# EAGLE schematic altera_dev_brd (EAGLE 4.16)
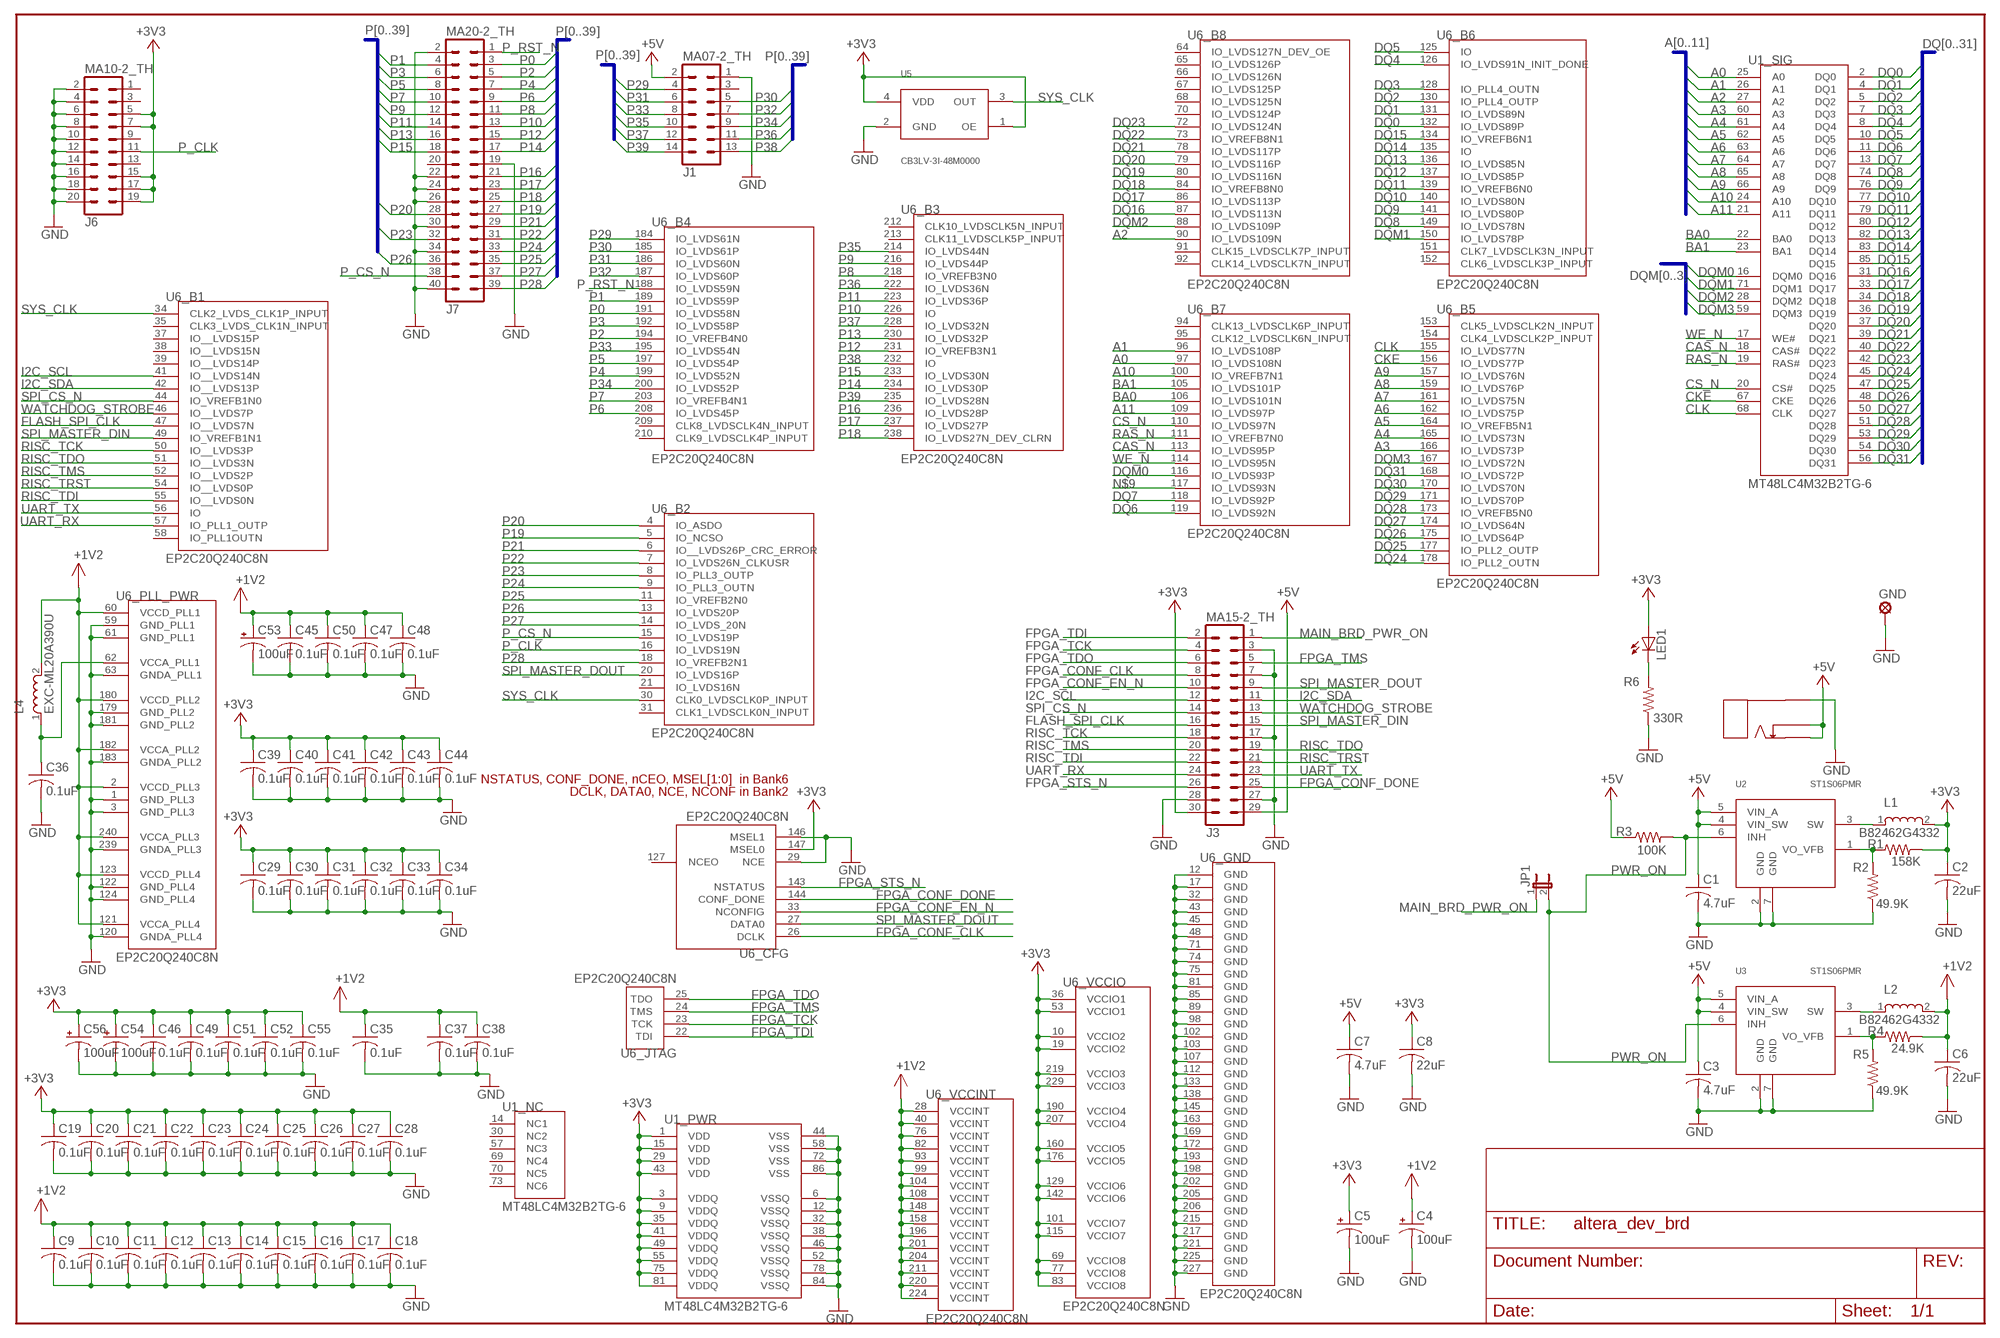
[diagram p0: schematic, sheet 1]

## Parts
C1  4.7uF  C-USC0805  [C0805]
C2  22uF  C-USC0805  [C0805]
C3  4.7uF  C-USC0805  [C0805]
C4  100uF  CPOL-USCT3528  [CT3528]
C5  100uF  CPOL-USCT3528  [CT3528]
C6  22uF  C-USC0805  [C0805]
C7  4.7uF  C-USC0805  [C0805]
C8  22uF  C-USC0805  [C0805]
C9  0.1uF  C-USC0603  [C0603]
C10  0.1uF  C-USC0603  [C0603]
C11  0.1uF  C-USC0603  [C0603]
C12  0.1uF  C-USC0603  [C0603]
C13  0.1uF  C-USC0603  [C0603]
C14  0.1uF  C-USC0603  [C0603]
C15  0.1uF  C-USC0603  [C0603]
C16  0.1uF  C-USC0603  [C0603]
C17  0.1uF  C-USC0603  [C0603]
C18  0.1uF  C-USC0603  [C0603]
C19  0.1uF  C-USC0603  [C0603]
C20  0.1uF  C-USC0603  [C0603]
C21  0.1uF  C-USC0603  [C0603]
C22  0.1uF  C-USC0603  [C0603]
C23  0.1uF  C-USC0603  [C0603]
C24  0.1uF  C-USC0603  [C0603]
C25  0.1uF  C-USC0603  [C0603]
C26  0.1uF  C-USC0603  [C0603]
C27  0.1uF  C-USC0603  [C0603]
C28  0.1uF  C-USC0603  [C0603]
C29  0.1uF  C-USC0603  [C0603]
C30  0.1uF  C-USC0603  [C0603]
C31  0.1uF  C-USC0603  [C0603]
C32  0.1uF  C-USC0603  [C0603]
C33  0.1uF  C-USC0603  [C0603]
C34  0.1uF  C-USC0603  [C0603]
C35  0.1uF  C-USC0603  [C0603]
C36  0.1uF  C-USC0603  [C0603]
C37  0.1uF  C-USC0603  [C0603]
C38  0.1uF  C-USC0603  [C0603]
C39  0.1uF  C-USC0603  [C0603]
C40  0.1uF  C-USC0603  [C0603]
C41  0.1uF  C-USC0603  [C0603]
C42  0.1uF  C-USC0603  [C0603]
C43  0.1uF  C-USC0603  [C0603]
C44  0.1uF  C-USC0603  [C0603]
C45  0.1uF  C-USC0603  [C0603]
C46  0.1uF  C-USC0603  [C0603]
C47  0.1uF  C-USC0603  [C0603]
C48  0.1uF  C-USC0603  [C0603]
C49  0.1uF  C-USC0603  [C0603]
C50  0.1uF  C-USC0603  [C0603]
C51  0.1uF  C-USC0603  [C0603]
C52  0.1uF  C-USC0603  [C0603]
C53  100uF  CPOL-USCT3528  [CT3528]
C54  100uF  CPOL-USCT3528  [CT3528]
C55  0.1uF  C-USC0603  [C0603]
C56  100uF  CPOL-USCT3528  [CT3528]
GND  LSP10  [LSP10]
J1  MA07-2_TH  [MA07-2_TH]
J2  RASH722  [RASH722]
J3  MA15-2_TH  [MA15-2_TH]
J6  MA10-2_TH  [MA10-2_TH]
J7  MA20-2_TH  [MA20-2_TH]
JP1  JP1E  [JP1]
L1  B82462G4332  [B82462G4]
L2  B82462G4332  [B82462G4]
L4  EXC-ML20A390U  [IND_PANASONIC_0603]
LED1  LEDCHIP-LED0603  [CHIP-LED0603]
R1  158K  R-US_R0603  [R0603]
R2  49.9K  R-US_R0603  [R0603]
R3  100K  R-US_R0603  [R0603]
R4  24.9K  R-US_R0603  [R0603]
R5  49.9K  R-US_R0603  [R0603]
R6  330R  R-US_R0603  [R0603]
U1  MT48LC4M32B2TG-6  [TSOP86]
U2  ST1S06PMR  [DFN6]
U3  ST1S06PMR  [DFN6]
U5  CB3LV-3I-48M0000  [OSC_7MM]
U6  EP2C20Q240C8N  [PQFP240]

## Nets
+1V2: C4.+ C6.1 C9.1 C10.1 C11.1 C12.1 C13.1 C14.1 C15.1 C16.1 C17.1 C18.1 C35.1 C37.1 C38.1 C45.1 C47.1 C48.1 C50.1 C53.+ L2.2 L4.2 R4.2 U6.2(_PLL_PWR:VCCD_PLL3) U6.28(_VCCINT:VCCINT) U6.40(_VCCINT:VCCINT) U6.60(_PLL_PWR:VCCD_PLL1) U6.76(_VCCINT:VCCINT) U6.82(_VCCINT:VCCINT) U6.93(_VCCINT:VCCINT) U6.99(_VCCINT:VCCINT) U6.104(_VCCINT:VCCINT) U6.108(_VCCINT:VCCINT) U6.121(_PLL_PWR:VCCA_PLL4) U6.123(_PLL_PWR:VCCD_PLL4) U6.148(_VCCINT:VCCINT) U6.158(_VCCINT:VCCINT) U6.180(_PLL_PWR:VCCD_PLL2) U6.182(_PLL_PWR:VCCA_PLL2) U6.196(_VCCINT:VCCINT) U6.201(_VCCINT:VCCINT) U6.204(_VCCINT:VCCINT) U6.211(_VCCINT:VCCINT) U6.220(_VCCINT:VCCINT) U6.224(_VCCINT:VCCINT) U6.240(_PLL_PWR:VCCA_PLL3)
+3V3: C2.1 C5.+ C8.1 C19.1 C20.1 C21.1 C22.1 C23.1 C24.1 C25.1 C26.1 C27.1 C28.1 C29.1 C30.1 C31.1 C32.1 C33.1 C34.1 C39.1 C40.1 C41.1 C42.1 C43.1 C44.1 C46.1 C49.1 C51.1 C52.1 C54.+ C55.1 C56.+ J3.30 J6.5 J6.7 J6.15 J6.17 J6.19 L1.2 LED1.A R1.2 U1.1(_PWR:VDD) U1.3(_PWR:VDDQ) U1.9(_PWR:VDDQ) U1.15(_PWR:VDD) U1.29(_PWR:VDD) U1.35(_PWR:VDDQ) U1.41(_PWR:VDDQ) U1.43(_PWR:VDD) U1.49(_PWR:VDDQ) U1.55(_PWR:VDDQ) U1.75(_PWR:VDDQ) U1.81(_PWR:VDDQ) U5.1(OE) U5.4(VDD) U6.10(_VCCIO:VCCIO2) U6.19(_VCCIO:VCCIO2) U6.36(_VCCIO:VCCIO1) U6.53(_VCCIO:VCCIO1) U6.69(_VCCIO:VCCIO8) U6.77(_VCCIO:VCCIO8) U6.83(_VCCIO:VCCIO8) U6.101(_VCCIO:VCCIO7) U6.115(_VCCIO:VCCIO7) U6.129(_VCCIO:VCCIO6) U6.142(_VCCIO:VCCIO6) U6.147(_CFG:MSEL0) U6.160(_VCCIO:VCCIO5) U6.176(_VCCIO:VCCIO5) U6.190(_VCCIO:VCCIO4) U6.207(_VCCIO:VCCIO4) U6.219(_VCCIO:VCCIO3) U6.229(_VCCIO:VCCIO3)
+5V: C1.1 C3.1 C7.1 J1.2 J2.2(SHNT) J2.3(CNTR) J3.29 R3.1 U2.4(VIN_SW) U2.5(VIN_A) U3.4(VIN_SW) U3.5(VIN_A)
A0: U1.25(_SIG:A0) U6.97(_B7:IO_LVDS108N)
A1: U1.26(_SIG:A1) U6.96(_B7:IO_LVDS108P)
A2: U1.27(_SIG:A2) U6.90(_B8:IO_LVDS109N)
A3: U1.60(_SIG:A3) U6.166(_B5:IO_LVDS73P)
A4: U1.61(_SIG:A4) U6.165(_B5:IO_LVDS73N)
A5: U1.62(_SIG:A5) U6.164(_B5:IO_VREFB5N1)
A6: U1.63(_SIG:A6) U6.162(_B5:IO_LVDS75P)
A7: U1.64(_SIG:A7) U6.161(_B5:IO_LVDS75N)
A8: U1.65(_SIG:A8) U6.159(_B5:IO_LVDS76P)
A9: U1.66(_SIG:A9) U6.157(_B5:IO_LVDS76N)
A10: U1.24(_SIG:A10) U6.100(_B7:IO_VREFB7N1)
A11: U1.21(_SIG:A11) U6.109(_B7:IO_LVDS97P)
BA0: U1.22(_SIG:BA0) U6.106(_B7:IO_LVDS101N)
BA1: U1.23(_SIG:BA1) U6.105(_B7:IO_LVDS101P)
CAS_N: U1.18(_SIG:CAS#) U6.113(_B7:IO_LVDS95P)
CKE: U1.67(_SIG:CKE) U6.156(_B5:IO_LVDS77P)
CLK: U1.68(_SIG:CLK) U6.155(_B5:IO_LVDS77N)
CS_N: U1.20(_SIG:CS#) U6.110(_B7:IO_LVDS97N)
DQ0: U1.2(_SIG:DQ0) U6.132(_B6:IO_LVDS89P)
DQ1: U1.4(_SIG:DQ1) U6.131(_B6:IO_LVDS89N)
DQ2: U1.5(_SIG:DQ2) U6.130(_B6:IO_PLL4_OUTP)
DQ3: U1.7(_SIG:DQ3) U6.128(_B6:IO_PLL4_OUTN)
DQ4: U1.8(_SIG:DQ4) U6.126(_B6:IO_LVDS91N_INIT_DONE)
DQ5: U1.10(_SIG:DQ5) U6.125(_B6:IO)
DQ6: U1.11(_SIG:DQ6) U6.119(_B7:IO_LVDS92N)
DQ7: U1.13(_SIG:DQ7) U6.118(_B7:IO_LVDS92P)
DQ8: U1.74(_SIG:DQ8) U6.149(_B6:IO_LVDS78N)
DQ9: U1.76(_SIG:DQ9) U6.141(_B6:IO_LVDS80P)
DQ10: U1.77(_SIG:DQ10) U6.140(_B6:IO_LVDS80N)
DQ11: U1.79(_SIG:DQ11) U6.139(_B6:IO_VREFB6N0)
DQ12: U1.80(_SIG:DQ12) U6.137(_B6:IO_LVDS85P)
DQ13: U1.82(_SIG:DQ13) U6.136(_B6:IO_LVDS85N)
DQ14: U1.83(_SIG:DQ14) U6.135(_B6:IO)
DQ15: U1.85(_SIG:DQ15) U6.134(_B6:IO_VREFB6N1)
DQ16: U1.31(_SIG:DQ16) U6.87(_B8:IO_LVDS113N)
DQ17: U1.33(_SIG:DQ17) U6.86(_B8:IO_LVDS113P)
DQ18: U1.34(_SIG:DQ18) U6.84(_B8:IO_VREFB8N0)
DQ19: U1.36(_SIG:DQ19) U6.80(_B8:IO_LVDS116N)
DQ20: U1.37(_SIG:DQ20) U6.79(_B8:IO_LVDS116P)
DQ21: U1.39(_SIG:DQ21) U6.78(_B8:IO_LVDS117P)
DQ22: U1.40(_SIG:DQ22) U6.73(_B8:IO_VREFB8N1)
DQ23: U1.42(_SIG:DQ23) U6.72(_B8:IO_LVDS124N)
DQ24: U1.45(_SIG:DQ24) U6.178(_B5:IO_PLL2_OUTN)
DQ25: U1.47(_SIG:DQ25) U6.177(_B5:IO_PLL2_OUTP)
DQ26: U1.48(_SIG:DQ26) U6.175(_B5:IO_LVDS64P)
DQ27: U1.50(_SIG:DQ27) U6.174(_B5:IO_LVDS64N)
DQ28: U1.51(_SIG:DQ28) U6.173(_B5:IO_VREFB5N0)
DQ29: U1.53(_SIG:DQ29) U6.171(_B5:IO_LVDS70P)
DQ30: U1.54(_SIG:DQ30) U6.170(_B5:IO_LVDS70N)
DQ31: U1.56(_SIG:DQ31) U6.168(_B5:IO_LVDS72P)
DQM0: U1.16(_SIG:DQM0) U6.116(_B7:IO_LVDS93P)
DQM1: U1.71(_SIG:DQM1) U6.150(_B6:IO_LVDS78P)
DQM2: U1.28(_SIG:DQM2) U6.88(_B8:IO_LVDS109P)
DQM3: U1.59(_SIG:DQM3) U6.167(_B5:IO_LVDS72N)
FLASH_SPI_CLK: J3.16 U6.47(_B1:IO__LVDS7N)
FPGA_CONF_CLK: J3.8 U6.26(_CFG:DCLK)
FPGA_CONF_DONE: J3.25 U6.144(_CFG:CONF_DONE)
FPGA_CONF_EN_N: J3.10 U6.33(_CFG:NCONFIG)
FPGA_STS_N: J3.26 U6.143(_CFG:NSTATUS)
FPGA_TCK: J3.4 U6.23(_JTAG:TCK)
FPGA_TDI: J3.2 U6.22(_JTAG:TDI)
FPGA_TDO: J3.6 U6.25(_JTAG:TDO)
FPGA_TMS: J3.5 U6.24(_JTAG:TMS)
GND: C1.2 C2.2 C3.2 C4.- C5.- C6.2 C7.2 C8.2 C9.2 C10.2 C11.2 C12.2 C13.2 C14.2 C15.2 C16.2 C17.2 C18.2 C19.2 C20.2 C21.2 C22.2 C23.2 C24.2 C25.2 C26.2 C27.2 C28.2 C29.2 C30.2 C31.2 C32.2 C33.2 C34.2 C35.2 C36.2 C37.2 C38.2 C39.2 C40.2 C41.2 C42.2 C43.2 C44.2 C45.2 C46.2 C47.2 C48.2 C49.2 C50.2 C51.2 C52.2 C53.- C54.- C55.2 C56.- GND.MP J1.1 J2.1(SLVE) J3.3 J3.7 J3.17 J3.27 J3.28 J6.2 J6.4 J6.6 J6.8 J6.10 J6.12 J6.14 J6.16 J6.18 J6.20 J7.2 J7.19 J7.22 J7.24 J7.26 J7.30 J7.34 J7.40 R2.1 R5.1 R6.1 U1.6(_PWR:VSSQ) U1.12(_PWR:VSSQ) U1.32(_PWR:VSSQ) U1.38(_PWR:VSSQ) U1.44(_PWR:VSS) U1.46(_PWR:VSSQ) U1.52(_PWR:VSSQ) U1.58(_PWR:VSS) U1.72(_PWR:VSS) U1.78(_PWR:VSSQ) U1.84(_PWR:VSSQ) U1.86(_PWR:VSS) U2.2(GND) U2.7(GND) U3.2(GND) U3.7(GND) U5.2(GND) U6.1(_PLL_PWR:GND_PLL3) U6.3(_PLL_PWR:GND_PLL3) U6.12(_GND:GND) U6.17(_GND:GND) U6.29(_CFG:NCE) U6.32(_GND:GND) U6.43(_GND:GND) U6.45(_GND:GND) U6.48(_GND:GND) U6.59(_PLL_PWR:GND_PLL1) U6.61(_PLL_PWR:GND_PLL1) U6.63(_PLL_PWR:GNDA_PLL1) U6.71(_GND:GND) U6.74(_GND:GND) U6.75(_GND:GND) U6.81(_GND:GND) U6.85(_GND:GND) U6.89(_GND:GND) U6.98(_GND:GND) U6.102(_GND:GND) U6.103(_GND:GND) U6.107(_GND:GND) U6.112(_GND:GND) U6.120(_PLL_PWR:GNDA_PLL4) U6.122(_PLL_PWR:GND_PLL4) U6.124(_PLL_PWR:GND_PLL4) U6.133(_GND:GND) U6.138(_GND:GND) U6.145(_GND:GND) U6.146(_CFG:MSEL1) U6.163(_GND:GND) U6.169(_GND:GND) U6.172(_GND:GND) U6.179(_PLL_PWR:GND_PLL2) U6.181(_PLL_PWR:GND_PLL2) U6.183(_PLL_PWR:GNDA_PLL2) U6.193(_GND:GND) U6.198(_GND:GND) U6.202(_GND:GND) U6.205(_GND:GND) U6.206(_GND:GND) U6.215(_GND:GND) U6.217(_GND:GND) U6.221(_GND:GND) U6.225(_GND:GND) U6.227(_GND:GND) U6.239(_PLL_PWR:GNDA_PLL3)
I2C_SCL: J3.12 U6.41(_B1:IO__LVDS14N)
I2C_SDA: J3.11 U6.42(_B1:IO__LVDS13P)
MAIN_BRD_PWR_ON: J3.1 JP1.1
N$1: L1.1 U2.3(SW)
N$2: R1.1 R2.2 U2.1(VO_VFB)
N$3: L2.1 U3.3(SW)
N$4: R4.1 R5.2 U3.1(VO_VFB)
N$5: C36.1 L4.1 U6.62(_PLL_PWR:VCCA_PLL1)
N$6: LED1.C R6.2
N$9: U6.117(_B7:IO_LVDS93N)
P0: J7.3 U6.191(_B4:IO_LVDS58N)
P1: J7.4 U6.189(_B4:IO_LVDS59P)
P2: J7.5 U6.194(_B4:IO_VREFB4N0)
P3: J7.6 U6.192(_B4:IO_LVDS58P)
P4: J7.7 U6.199(_B4:IO_LVDS52N)
P5: J7.8 U6.197(_B4:IO_LVDS54P)
P6: J7.9 U6.208(_B4:IO_LVDS45P)
P7: J7.10 U6.203(_B4:IO_VREFB4N1)
P8: J7.11 U6.218(_B3:IO_VREFB3N0)
P9: J7.12 U6.216(_B3:IO_LVDS44P)
P10: J7.13 U6.226(_B3:IO)
P11: J7.14 U6.223(_B3:IO_LVDS36P)
P12: J7.15 U6.231(_B3:IO_VREFB3N1)
P13: J7.16 U6.230(_B3:IO_LVDS32P)
P14: J7.17 U6.234(_B3:IO_LVDS30P)
P15: J7.18 U6.233(_B3:IO_LVDS30N)
P16: J7.21 U6.236(_B3:IO_LVDS28P)
P17: J7.23 U6.237(_B3:IO_LVDS27P)
P18: J7.25 U6.238(_B3:IO_LVDS27N_DEV_CLRN)
P19: J7.27 U6.5(_B2:IO_NCSO)
P20: J7.28 U6.4(_B2:IO_ASDO)
P21: J7.29 U6.6(_B2:IO__LVDS26P_CRC_ERROR)
P22: J7.31 U6.7(_B2:IO_LVDS26N_CLKUSR)
P23: J7.32 U6.8(_B2:IO_PLL3_OUTP)
P24: J7.33 U6.9(_B2:IO_PLL3_OUTN)
P25: J7.35 U6.11(_B2:IO_VREFB2N0)
P26: J7.36 U6.13(_B2:IO_LVDS20P)
P27: J7.37 U6.14(_B2:IO_LVDS_20N)
P28: J7.39 U6.18(_B2:IO_VREFB2N1)
P29: J1.4 U6.184(_B4:IO_LVDS61N)
P30: J1.5 U6.185(_B4:IO_LVDS61P)
P31: J1.6 U6.186(_B4:IO_LVDS60N)
P32: J1.7 U6.187(_B4:IO_LVDS60P)
P33: J1.8 U6.195(_B4:IO_LVDS54N)
P34: J1.9 U6.200(_B4:IO_LVDS52P)
P35: J1.10 U6.214(_B3:IO_LVDS44N)
P36: J1.11 U6.222(_B3:IO_LVDS36N)
P37: J1.12 U6.228(_B3:IO_LVDS32N)
P38: J1.13 U6.232(_B3:IO)
P39: J1.14 U6.235(_B3:IO_LVDS28N)
P_CLK: J6.11 U6.16(_B2:IO_LVDS19N)
P_CS_N: J7.38 U6.15(_B2:IO_LVDS19P)
P_RST_N: J7.1 U6.188(_B4:IO_LVDS59N)
PWR_ON: JP1.2 R3.2 U2.6(INH) U3.6(INH)
RAS_N: U1.19(_SIG:RAS#) U6.111(_B7:IO_VREFB7N0)
RISC_TCK: J3.18 U6.50(_B1:IO__LVDS3P)
RISC_TDI: J3.22 U6.55(_B1:IO__LVDS0N)
RISC_TDO: J3.19 U6.51(_B1:IO__LVDS3N)
RISC_TMS: J3.20 U6.52(_B1:IO__LVDS2P)
RISC_TRST: J3.21 U6.54(_B1:IO__LVDS0P)
SPI_CS_N: J3.14 U6.44(_B1:IO_VREFB1N0)
SPI_MASTER_DIN: J3.15 U6.49(_B1:IO_VREFB1N1)
SPI_MASTER_DOUT: J3.9 U6.20(_B2:IO_LVDS16P) U6.27(_CFG:DATA0)
SYS_CLK: U5.3(OUT) U6.30(_B2:CLK0_LVDSCLK0P_INPUT) U6.34(_B1:CLK2_LVDS_CLK1P_INPUT)
UART_RX: J3.24 U6.57(_B1:IO_PLL1_OUTP)
UART_TX: J3.23 U6.56(_B1:IO)
WATCHDOG_STROBE: J3.13 U6.46(_B1:IO__LVDS7P)
WE_N: U1.17(_SIG:WE#) U6.114(_B7:IO_LVDS95N)
Unconnected: J1.3 J6.1 J6.3 J6.9 J6.13 J7.20 U6.21(_B2:IO_LVDS16N) U6.31(_B2:CLK1_LVDSCLK0N_INPUT) U6.35(_B1:CLK3_LVDS_CLK1N_INPUT) U6.37(_B1:IO__LVDS15P) U6.38(_B1:IO__LVDS15N) U6.39(_B1:IO__LVDS14P) U6.58(_B1:IO_PLL1OUTN) U6.64(_B8:IO_LVDS127N_DEV_OE) U6.65(_B8:IO_LVDS126P) U6.66(_B8:IO_LVDS126N) U6.67(_B8:IO_LVDS125P) U6.68(_B8:IO_LVDS125N) U6.70(_B8:IO_LVDS124P) U6.91(_B8:CLK15_LVDSCLK7P_INPUT) U6.92(_B8:CLK14_LVDSCLK7N_INPUT) U6.94(_B7:CLK13_LVDSCLK6P_INPUT) U6.95(_B7:CLK12_LVDSCLK6N_INPUT) U6.127(_CFG:NCEO) U6.151(_B6:CLK7_LVDSCLK3N_INPUT) U6.152(_B6:CLK6_LVDSCLK3P_INPUT) U6.153(_B5:CLK5_LVDSCLK2N_INPUT) U6.154(_B5:CLK4_LVDSCLK2P_INPUT) U6.209(_B4:CLK8_LVDSCLK4N_INPUT) U6.210(_B4:CLK9_LVDSCLK4P_INPUT) U6.212(_B3:CLK10_LVDSCLK5N_INPUT) U6.213(_B3:CLK11_LVDSCLK5P_INPUT)

## Buses
DQ[0..31]
A[0..11]
DQM[0..3]
P[0..39]

## Power pins joined to a net without a drawn wire
NC1: U1.14(_NC:NC1)
NC2: U1.30(_NC:NC2)
NC3: U1.57(_NC:NC3)
NC4: U1.69(_NC:NC4)
NC5: U1.70(_NC:NC5)
NC6: U1.73(_NC:NC6)

## Library data of the parts
C1-C3 C6-C52 C55 = rcl:C-US: CAPACITOR, American symbol
C4 C5 C53 C54 C56 = rcl:CPOL-US: POLARIZED CAPACITOR, American symbol
GND = solpad:LSP10: SOLDER PAD drill 1.0 mm, distributor Buerklin, 12H555
J1 = base2designs:MA07-2_TH
J2 = base2designs:RASH722
J3 = base2designs:MA15-2_TH
J6 = base2designs:MA10-2_TH
J7 = base2designs:MA20-2_TH
JP1 = jumper:JP1E: JUMPER
L1 L2 = base2designs:B82462G4332
L4 = base2designs:EXC-ML20A390U
LED1 = led:LED: LED OSRAM: - CHIPLED LG R971, LG N971, LY N971, LG Q971, LY Q971, LO R971, LY R971 LH N974, LH R974 LS Q976, LO Q976, LY Q976 LO Q996 - Hyper CHIPLED LW Q18S LB Q993, LB Q99A, LB R99A - SideLED LS A670, LO A670, LY A670, LG A670, LP A670 LB A673, LV A673, LT A673, LW A673 LH A674 LY A675 LS A676, LA A676, LO A676, LY A676, LW A676 LS A679, LY A679, LG A679 - Hyper Micro SIDELED® LS Y876, LA Y876, LO Y876, LY Y876 LT Y87S - SmartLED LW L88C, LW L88S LB L89C, LB L89S, LG L890 LS L89K, LO L89K, LY L89K LS L896, LA L896, LO L896, LY L896 - TOPLED LS T670, LO T670, LY T670, LG T670, LP T670 LSG T670, LSP T670, LSY T670, LOP T670, LYG T670 LG T671, LOG T671, LSG T671 LB T673, LV T673, LT T673, LW T673 LH T674 LS T676, LA T676, LO T676, LY T676, LB T676, LH T676, LSB T676, LW T676 LB T67C, LV T67C, LT T67C, LS T67K, LO T67K, LY T67K, LW E67C LS E67B, LA E67B, LO E67B, LY E67B, LB E67C, LV E67C, LT E67C LW T67C LS T679, LY T679, LG T679 LS T770, LO T770, LY T770, LG T770, LP T770 LB T773, LV T773, LT T773, LW T773 LH T774 LS E675, LA E675, LY E675, LS T675 LS T776, LA T776, LO T776, LY T776, LB T776 LHGB T686 LT T68C, LB T68C - Hyper Mini TOPLED® LB M676 - Mini TOPLED Santana® LG M470 LS M47K, LO M47K, LY M47K Source: http://www.osram.convergy.de - LUMILED® LXK2-PW12-R00, LXK2-PW12-S00, LXK2-PW14-U00, LXK2-PW14-V00 LXK2-PM12-R00, LXK2-PM12-S00, LXK2-PM14-U00 LXK2-PE12-Q00, LXK2-PE12-R00, LXK2-PE12-S00, LXK2-PE14-T00, LXK2-PE14-U00 LXK2-PB12-K00, LXK2-PB12-L00, LXK2-PB12-M00, LXK2-PB14-N00, LXK2-PB14-P00, LXK2-PB14-Q00 LXK2-PR12-L00, LXK2-PR12-M00, LXK2-PR14-Q00, LXK2-PR14-R00 LXK2-PD12-Q00, LXK2-PD12-R00, LXK2-PD12-S00 LXK2-PH12-R00, LXK2-PH12-S00 LXK2-PL12-P00, LXK2-PL12-Q00, LXK2-PL12-R00 Source: www.luxeon.com
R1-R6 = rcl:R-US_: RESISTOR, American symbol
U1 = base2designs:MT48LC4M32B2TG-6: Micron 4M x 32 SDR SDRAM
U2 U3 = base2designs:ST1S06PMR
U5 = base2designs:CB3LV-3I-48M0000
U6 = base2designs:EP2C20Q240C8N: EP2C20 Cyclone 2 family